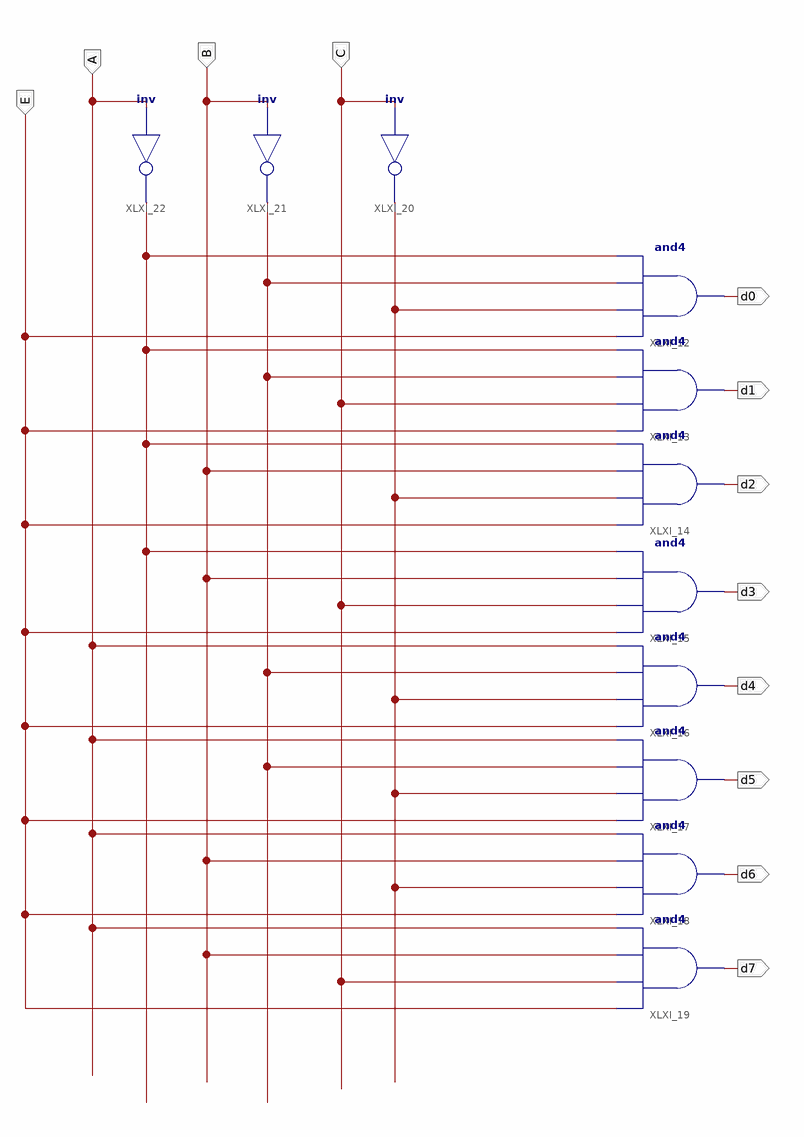
[diagram p0: schematic sheet 1]
// Xilinx ISE schematic sprinkler_circuit.sch (aspartan3e) as structural Verilog: 11 symbols, 12 ports
module sprinkler_circuit (
  input  E,
  input  A,
  input  B,
  input  C,
  output d0,
  output d1,
  output d2,
  output d3,
  output d4,
  output d5,
  output d6,
  output d7
);

  wire XLXN_20, XLXN_21, XLXN_22;

  and XLXI_12 (d0, E, XLXN_20, XLXN_21, XLXN_22);
  and XLXI_13 (d1, E, C, XLXN_21, XLXN_22);
  and XLXI_14 (d2, E, XLXN_20, B, XLXN_22);
  and XLXI_15 (d3, E, C, B, XLXN_22);
  and XLXI_16 (d4, E, XLXN_20, XLXN_21, A);
  and XLXI_17 (d5, E, XLXN_20, XLXN_21, A);
  and XLXI_18 (d6, E, XLXN_20, B, A);
  and XLXI_19 (d7, E, C, B, A);
  not XLXI_20 (XLXN_20, C);
  not XLXI_21 (XLXN_21, B);
  not XLXI_22 (XLXN_22, A);
endmodule
